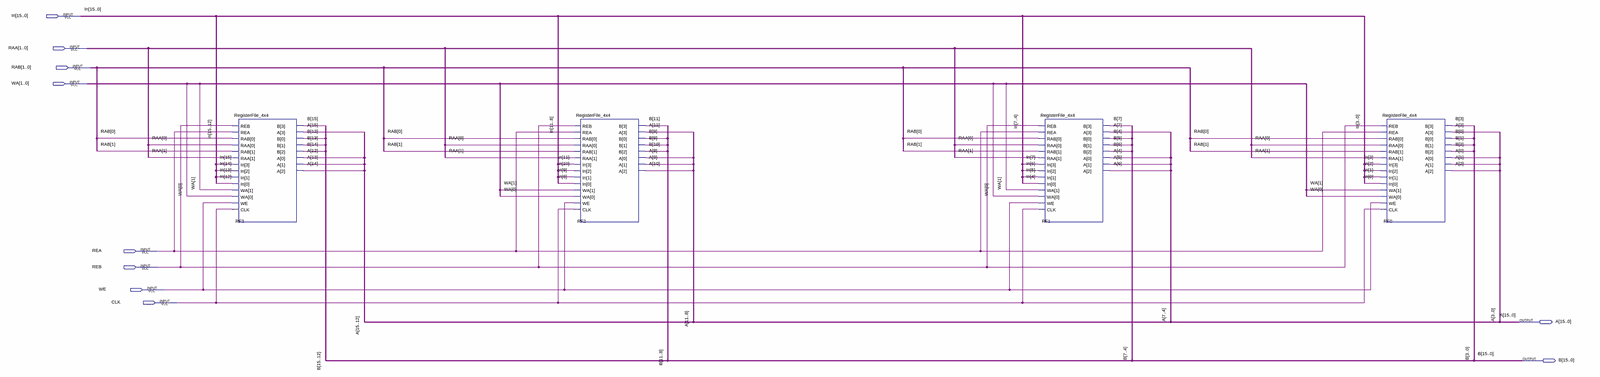
[diagram p0: schematic sheet, whole]
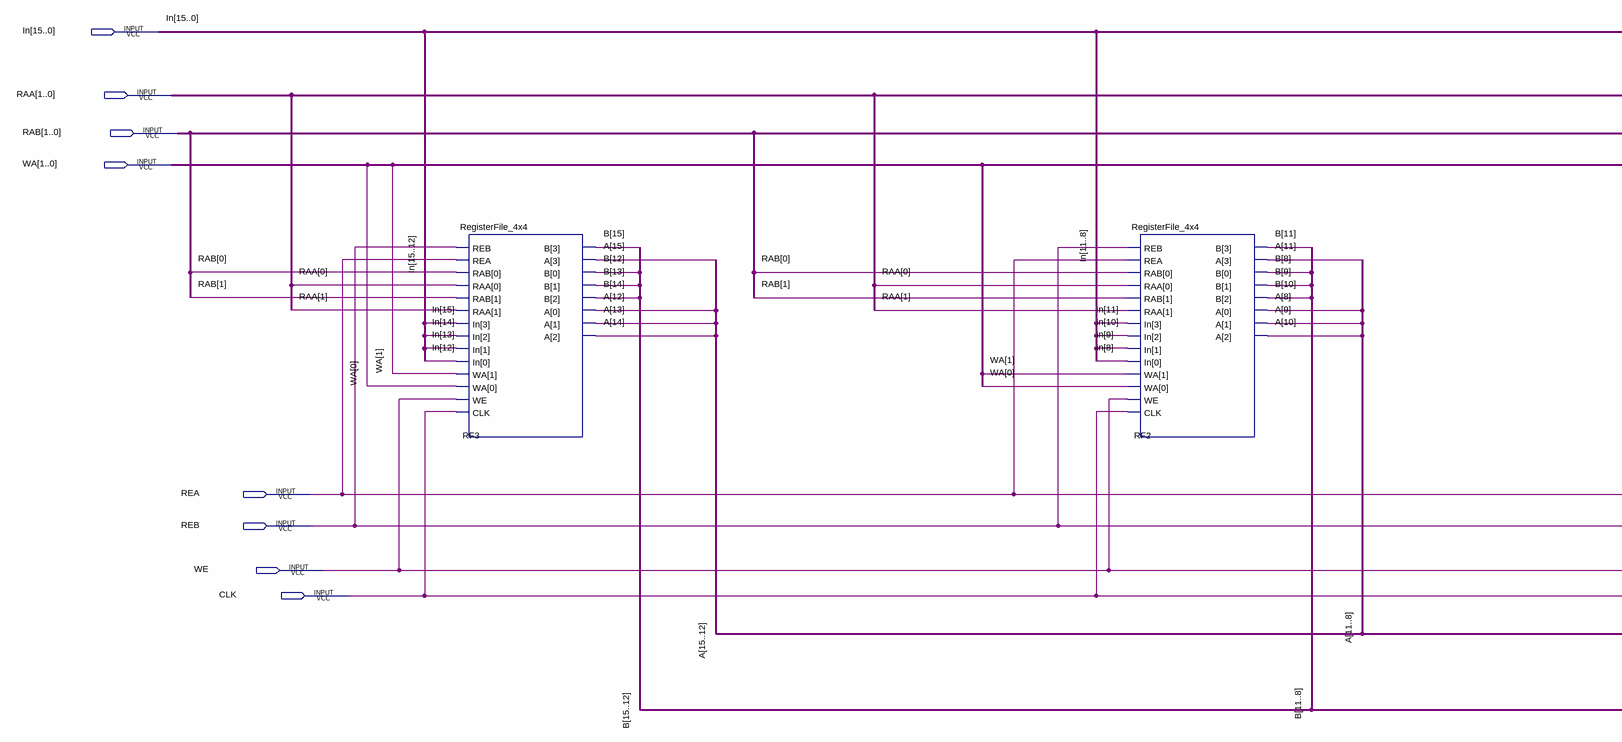
[diagram p1: schematic sheet, left part]
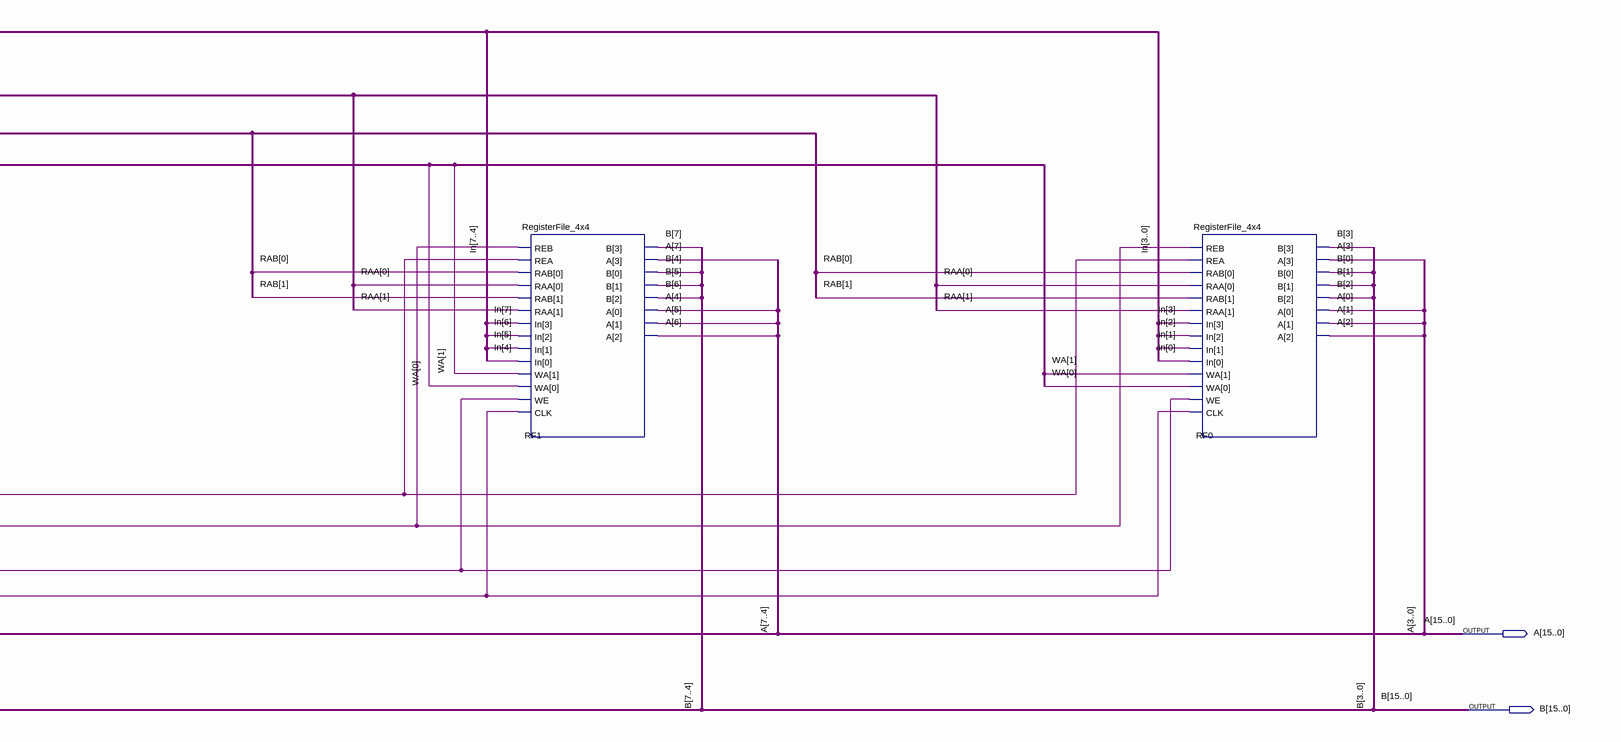
[diagram p2: schematic sheet, right part]
// Quartus schematic RegisterFile_16bit.bdf as structural Verilog: 4 symbols, 10 pins
module RegisterFile_16bit (
  input  [15:0] In,
  input  [1:0] RAA,
  input  [1:0] RAB,
  input  [1:0] WA,
  input  REA,
  input  REB,
  input  WE,
  input  CLK,
  output [15:0] A,
  output [15:0] B
);

  RegisterFile_4x4 RF3 (
    .REB(REB), .REA(REA), .RAB(RAB), .RAA(RAA), .In(In[15:12]), .WA(WA), .WE(WE), .CLK(CLK), .B(B[15:12]),
    .A(A[15:12]));
  RegisterFile_4x4 RF2 (
    .REB(REB), .REA(REA), .RAB(RAB), .RAA(RAA), .In(In[11:8]), .WA(WA), .WE(WE), .CLK(CLK), .B(B[11:8]),
    .A(A[11:8]));
  RegisterFile_4x4 RF1 (
    .REB(REB), .REA(REA), .RAB(RAB), .RAA(RAA), .In(In[7:4]), .WA(WA), .WE(WE), .CLK(CLK), .B(B[7:4]),
    .A(A[7:4]));
  RegisterFile_4x4 RF0 (
    .REB(REB), .REA(REA), .RAB(RAB), .RAA(RAA), .In(In[3:0]), .WA(WA), .WE(WE), .CLK(CLK), .B(B[3:0]),
    .A(A[3:0]));
endmodule
